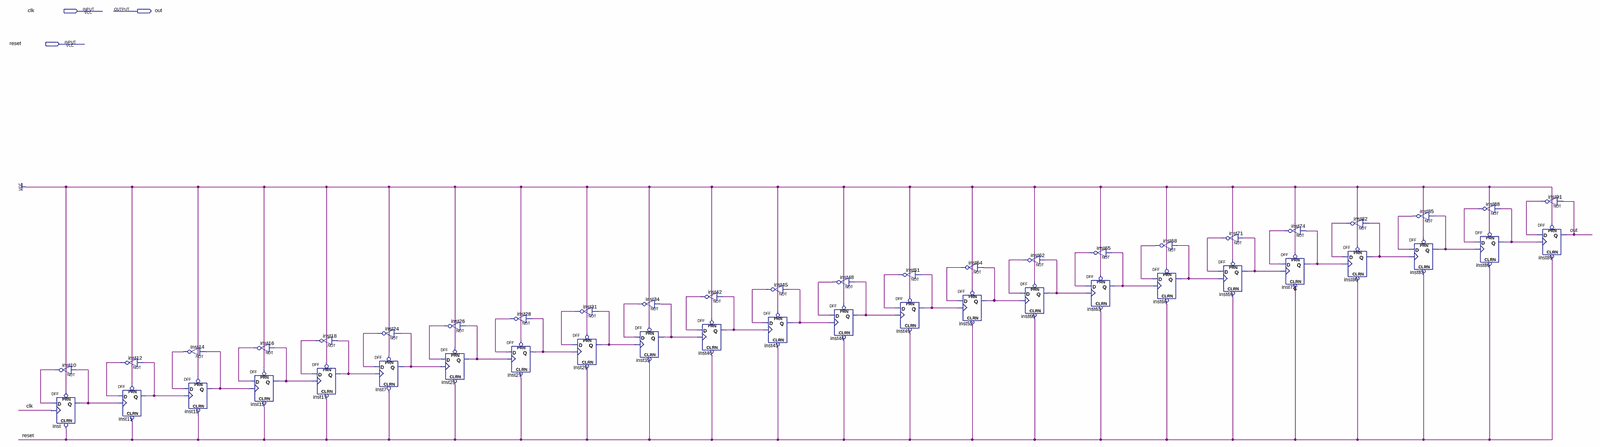
[diagram p0: schematic sheet, whole]
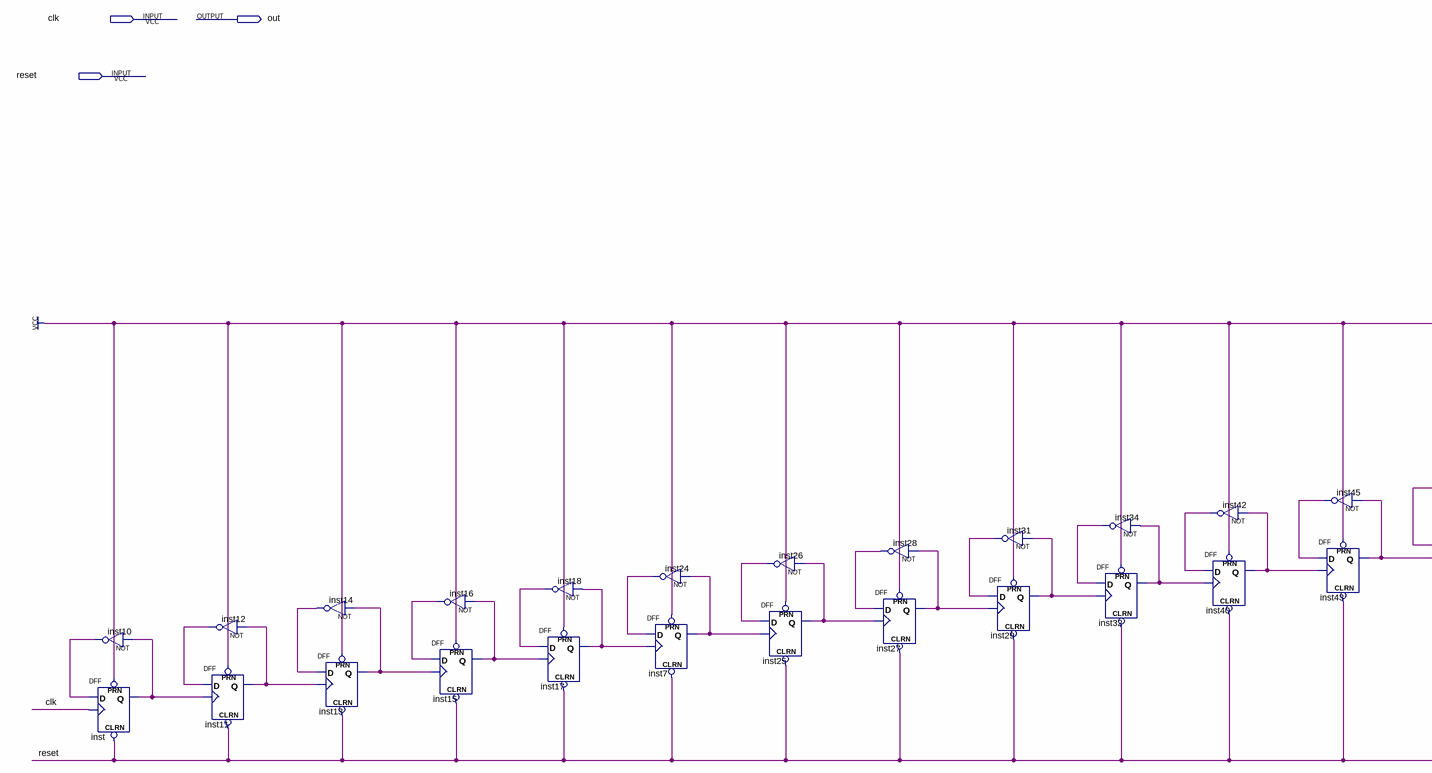
[diagram p1: schematic sheet, left part]
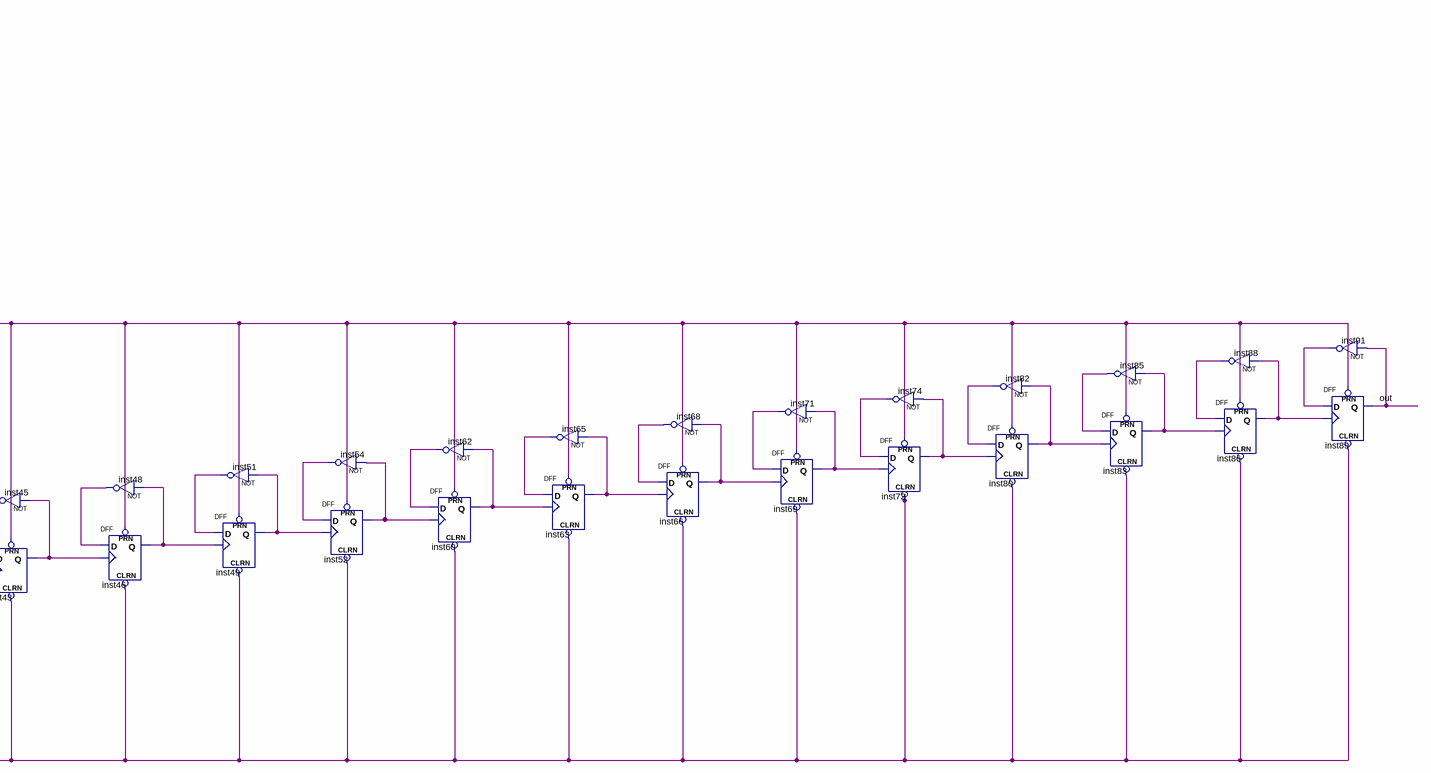
[diagram p2: schematic sheet, right part]
// Quartus schematic Divisor.bdf as structural Verilog: 48 symbols, 3 pins
module Divisor (
  input  clk,
  input  reset,
  output out
);

  wire inst7_q, inst10_out, inst11_q, inst12_out, inst13_q, inst14_out, inst15_q, inst16_out, inst17_q,
       inst18_out, inst24_out, inst25_q, inst26_out, inst27_q, inst28_out, inst29_q, inst31_out, inst32_q,
       inst34_out, inst40_q, inst42_out, inst43_q, inst45_out, inst46_q, inst48_out, inst49_q, inst51_out,
       inst52_q, inst54_out, inst60_q, inst62_out, inst63_q, inst65_out, inst66_q, inst68_out, inst69_q,
       inst71_out, inst72_q, inst74_out, inst80_q, inst82_out, inst83_q, inst85_out, inst86_q, inst88_out,
       inst91_out, inst_q;

  DFF inst (.CLRN(reset), .CLK(clk), .D(inst10_out), .PRN(1'b1), .Q(inst_q));
  not inst10 (inst10_out, inst_q);
  not inst12 (inst12_out, inst11_q);
  DFF inst11 (.CLRN(reset), .CLK(inst_q), .D(inst12_out), .PRN(1'b1), .Q(inst11_q));
  not inst14 (inst14_out, inst13_q);
  DFF inst13 (.CLRN(reset), .CLK(inst11_q), .D(inst14_out), .PRN(1'b1), .Q(inst13_q));
  not inst16 (inst16_out, inst15_q);
  DFF inst15 (.CLRN(reset), .CLK(inst13_q), .D(inst16_out), .PRN(1'b1), .Q(inst15_q));
  not inst18 (inst18_out, inst17_q);
  DFF inst17 (.CLRN(reset), .CLK(inst15_q), .D(inst18_out), .PRN(1'b1), .Q(inst17_q));
  DFF inst7 (.CLRN(reset), .CLK(inst17_q), .D(inst24_out), .PRN(1'b1), .Q(inst7_q));
  not inst24 (inst24_out, inst7_q);
  not inst26 (inst26_out, inst25_q);
  DFF inst25 (.CLRN(reset), .CLK(inst7_q), .D(inst26_out), .PRN(1'b1), .Q(inst25_q));
  not inst28 (inst28_out, inst27_q);
  DFF inst27 (.CLRN(reset), .CLK(inst25_q), .D(inst28_out), .PRN(1'b1), .Q(inst27_q));
  not inst31 (inst31_out, inst29_q);
  DFF inst29 (.CLRN(reset), .CLK(inst27_q), .D(inst31_out), .PRN(1'b1), .Q(inst29_q));
  not inst34 (inst34_out, inst32_q);
  DFF inst32 (.CLRN(reset), .CLK(inst29_q), .D(inst34_out), .PRN(1'b1), .Q(inst32_q));
  DFF inst40 (.CLRN(reset), .CLK(inst32_q), .D(inst42_out), .PRN(1'b1), .Q(inst40_q));
  not inst42 (inst42_out, inst40_q);
  not inst45 (inst45_out, inst43_q);
  DFF inst43 (.CLRN(reset), .CLK(inst40_q), .D(inst45_out), .PRN(1'b1), .Q(inst43_q));
  not inst48 (inst48_out, inst46_q);
  DFF inst46 (.CLRN(reset), .CLK(inst43_q), .D(inst48_out), .PRN(1'b1), .Q(inst46_q));
  not inst51 (inst51_out, inst49_q);
  DFF inst49 (.CLRN(reset), .CLK(inst46_q), .D(inst51_out), .PRN(1'b1), .Q(inst49_q));
  not inst54 (inst54_out, inst52_q);
  DFF inst52 (.CLRN(reset), .CLK(inst49_q), .D(inst54_out), .PRN(1'b1), .Q(inst52_q));
  DFF inst60 (.CLRN(reset), .CLK(inst52_q), .D(inst62_out), .PRN(1'b1), .Q(inst60_q));
  not inst62 (inst62_out, inst60_q);
  not inst65 (inst65_out, inst63_q);
  DFF inst63 (.CLRN(reset), .CLK(inst60_q), .D(inst65_out), .PRN(1'b1), .Q(inst63_q));
  not inst68 (inst68_out, inst66_q);
  DFF inst66 (.CLRN(reset), .CLK(inst63_q), .D(inst68_out), .PRN(1'b1), .Q(inst66_q));
  not inst71 (inst71_out, inst69_q);
  DFF inst69 (.CLRN(reset), .CLK(inst66_q), .D(inst71_out), .PRN(1'b1), .Q(inst69_q));
  not inst74 (inst74_out, inst72_q);
  DFF inst72 (.CLRN(reset), .CLK(inst69_q), .D(inst74_out), .PRN(1'b1), .Q(inst72_q));
  DFF inst80 (.CLRN(reset), .CLK(inst72_q), .D(inst82_out), .PRN(1'b1), .Q(inst80_q));
  not inst82 (inst82_out, inst80_q);
  not inst85 (inst85_out, inst83_q);
  DFF inst83 (.CLRN(reset), .CLK(inst80_q), .D(inst85_out), .PRN(1'b1), .Q(inst83_q));
  not inst88 (inst88_out, inst86_q);
  DFF inst86 (.CLRN(reset), .CLK(inst83_q), .D(inst88_out), .PRN(1'b1), .Q(inst86_q));
  not inst91 (inst91_out, out);
  DFF inst89 (.CLRN(reset), .CLK(inst86_q), .D(inst91_out), .PRN(1'b1), .Q(out));
endmodule
